# Altium schematic sheet logi-edu.SchDoc: Mark1 EDU Expansion
size B; Engineer: M. Jones; Organization: Michael Jones; Revision: RA.1; SheetNumber: 1; SheetTotal: 1; PageSetup: Record=PageOptions|CenterHorizontal=True|CenterVertical=True|PrintScale=0.70|XCorrection=1.00|YCorrection=1.00|PrintKind=0|BorderSize=5000000|LeftOffset=0|BottomOffset=0|Orientation=2|PaperLength=1000|PaperWidth=1000|Scale=100|PaperSource=7|PrintQuality=-4|MediaType=1|DitherType=10|PaperKind=Letter|PrintScaleMode=1
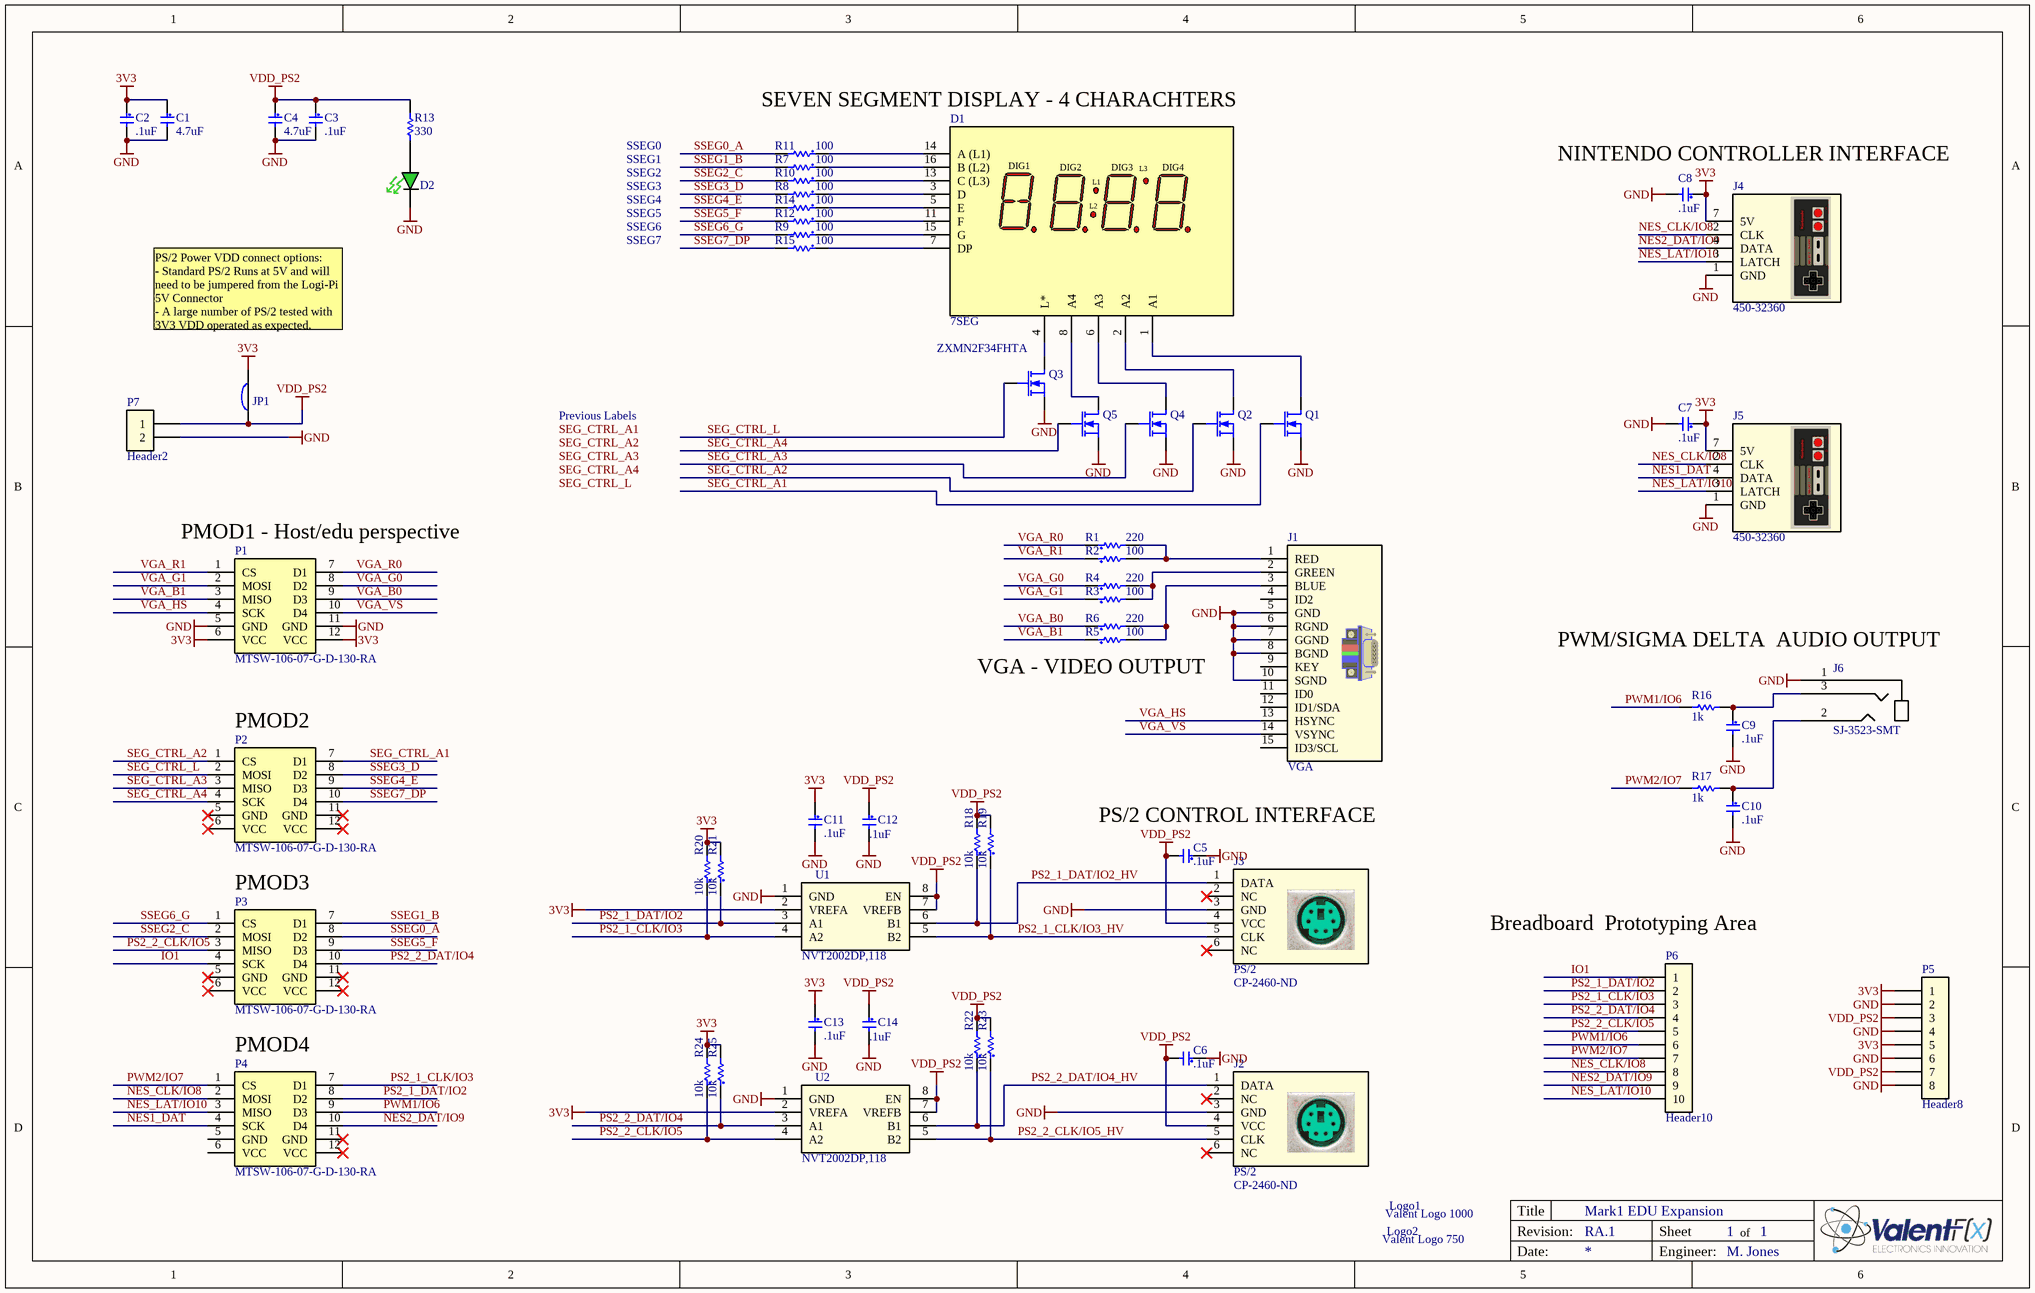
[diagram p0: logi-edu.SchDoc]

## Parts
C1  4.7uF  [C0603]
C2  .1uF  [C0603]
C3  .1uF  [C0603]
C4  4.7uF  [C0603]
C5  .1uF  [C0603]
C6  .1uF  [C0603]
C7  .1uF  [C0603]
C8  .1uF  [C0603]
C9  .1uF  [C0603]
C10  .1uF  [C0603]
C11  .1uF  [C0603]
C12  .1uF  [C0603]
C13  .1uF  [C0603]
C14  .1uF  [C0603]
D1  7SEG  [LED - SSEG - LTC-4727JR]
D2  LED 1.6X0.8MM 570NM GRN CLR SMD  [LED_0603 - GREEN]  (value not drawn)
J1  VGA  [1-1734530-1]
J2  PS/2  Supplier Part Number 1: CP-2460-ND  [MD-60S - PS/2]
J3  PS/2  Supplier Part Number 1: CP-2460-ND  [MD-60S - PS/2]
J4  450-32360  [NES - 450-32360]
J5  450-32360  [NES - 450-32360]
J6  SJ-3523-SMT  [SJ-3523-SMT]
JP1  Solder Jumper-NC  [SOLDER_JUMPER-NC]  (value not drawn)  (net tie, no BOM)
Logo1  Valent Logo 1000  [ValentFX_1000]
Logo2  Valent Logo 750  [ValentFX_750]
P1  MTSW-106-07-G-D-130-RA  [PMOD HEADER - Male]
P2  MTSW-106-07-G-D-130-RA  [PMOD HEADER - Male]
P3  MTSW-106-07-G-D-130-RA  [PMOD HEADER - Male]
P4  MTSW-106-07-G-D-130-RA  [PMOD HEADER - Male]
P5  Header8  [HEADER_8_40_100THRU SIP]
P6  Header10  [HEADER_10_40_100THRU SIP]
P7  Header2  [HEADER_2_40_100 THRU SIP]
Q1  ZXMN2F34FHTA  [SOT-23]  (value not drawn)
Q2  ZXMN2F34FHTA  [SOT-23]  (value not drawn)
Q3  ZXMN2F34FHTA  [SOT-23]
Q4  ZXMN2F34FHTA  [SOT-23]  (value not drawn)
Q5  ZXMN2F34FHTA  [SOT-23]  (value not drawn)
R1  220  [R0603]
R2  100  [R0603]
R3  100  [R0603]
R4  220  [R0603]
R5  100  [R0603]
R6  220  [R0603]
R7  100  [R0603]
R8  100  [R0603]
R9  100  [R0603]
R10  100  [R0603]
R11  100  [R0603]
R12  100  [R0603]
R13  330  [R0603]
R14  100  [R0603]
R15  100  [R0603]
R16  1k  [R0603]
R17  1k  [R0603]
R18  10k  [R0603]
R19  10k  [R0603]
R20  10k  [R0603]
R21  10k  [R0603]
R22  10k  [R0603]
R23  10k  [R0603]
R24  10k  [R0603]
R25  10k  [R0603]
U1  NVT2002DP,118  [NVT2002DP,118 - TSOP65P490X110-8L]
U2  NVT2002DP,118  [NVT2002DP,118 - TSOP65P490X110-8L]

## Nets
3V3: C1.1 C2.1 C7.1 C8.1 C11.1 C13.1 J4.7(5V) J5.7(5V) JP1.2 P1.6(VCC) P1.12(VCC) P5.1 P5.5 R20.2 R21.2 R24.2 R25.2 U1.2(VREFA) U2.2(VREFA)
GND: C1.2 C2.2 C3.2 C4.2 C5.1 C6.1 C7.2 C8.2 C9.2 C10.2 C11.2 C12.2 C13.2 C14.2 D2.C J1.5(GND) J1.6(RGND) J1.7(GGND) J1.8(BGND) J1.10(SGND) J2.3(GND) J3.3(GND) J4.1(GND) J5.1(GND) J6.1 P1.5(GND) P1.11(GND) P5.2 P5.4 P5.6 P5.8 P7.2 Q1.2 Q2.2 Q3.2 Q4.2 Q5.2 U1.1(GND) U2.1(GND)
VDD_PS2: C3.1 C4.1 C5.2 C6.2 C12.1 C14.1 J2.4(VCC) J3.4(VCC) JP1.1 P5.3 P5.7 P7.1 R13.1 R18.2 R19.2 R22.2 R23.2 U1.7(VREFB) U1.8(EN) U2.7(VREFB) U2.8(EN)
IO1: P3.4(SCK) P6.1
NES1_DAT: J5.4(DATA) P4.4(SCK)
NES2_DAT/IO9: J4.4(DATA) P4.10(D4) P6.9
NES_CLK/IO8: J4.2(CLK) J5.2(CLK) P4.2(MOSI) P6.8
NES_LAT/IO10: J4.3(LATCH) J5.3(LATCH) P4.3(MISO) P6.10
PS2_1_CLK/IO3: P4.7(D1) P6.3 R20.1 U1.4(A2)
PS2_1_CLK/IO3_HV: J3.5(CLK) R19.1 U1.5(B2)
PS2_1_DAT/IO2: P4.8(D2) P6.2 R21.1 U1.3(A1)
PS2_1_DAT/IO2_HV: J3.1(DATA) R18.1 U1.6(B1)
PS2_2_CLK/IO5: P3.3(MISO) P6.5 R24.1 U2.4(A2)
PS2_2_CLK/IO5_HV: J2.5(CLK) R23.1 U2.5(B2)
PS2_2_DAT/IO4: P3.10(D4) P6.4 R25.1 U2.3(A1)
PS2_2_DAT/IO4_HV: J2.1(DATA) R22.1 U2.6(B1)
PWM1/IO6: P4.9(D3) P6.6 R16.1
PWM2/IO7: P4.1(CS) P6.7 R17.1
SEG_CTRL_A1: P2.7(D1) Q1.1(G)
SEG_CTRL_A2: P2.1(CS) Q2.1(G)
SEG_CTRL_A3: P2.3(MISO) Q4.1(G)
SEG_CTRL_A4: P2.4(SCK) Q5.1(G)
SEG_CTRL_L: P2.2(MOSI) Q3.1(G)
SSEG0_A: P3.8(D2) R11.2
SSEG1_B: P3.7(D1) R7.2
SSEG2_C: P3.2(MOSI) R10.2
SSEG3_D: P2.8(D2) R8.2
SSEG4_E: P2.9(D3) R14.2
SSEG5_F: P3.9(D3) R12.2
SSEG6_G: P3.1(CS) R9.2
SSEG7_DP: P2.10(D4) R15.2
VGA_B0: P1.9(D3) R6.1
VGA_B1: P1.3(MISO) R5.1
VGA_G0: P1.8(D2) R4.1
VGA_G1: P1.2(MOSI) R3.1
VGA_HS: J1.13(HSYNC) P1.4(SCK)
VGA_R0: P1.7(D1) R1.1
VGA_R1: P1.1(CS) R2.1
VGA_VS: J1.14(VSYNC) P1.10(D4)
NetC9_1: C9.1 J6.3 R16.2
NetC10_1: C10.1 J6.2 R17.2
NetD1_1: D1.1(A1) Q1.3(D)
NetD1_2: D1.2(A2) Q2.3(D)
NetD1_3: D1.3(D) R8.1
NetD1_4: D1.4(L*) Q3.3(D)
NetD1_5: D1.5(E) R14.1
NetD1_6: D1.6(A3) Q4.3(D)
NetD1_7: D1.7(DP) R15.1
NetD1_8: D1.8(A4) Q5.3(D)
NetD1_11: D1.11(F) R12.1
NetD1_13: D1.13(C_(L3)) R10.1
NetD1_14: D1.14(A_(L1)) R11.1
NetD1_15: D1.15(G) R9.1
NetD1_16: D1.16(B_(L2)) R7.1
NetD2_A: D2.A R13.2
NetJ1_1: J1.1(RED) R1.2 R2.2
NetJ1_2: J1.2(GREEN) R3.2 R4.2
NetJ1_3: J1.3(BLUE) R5.2 R6.2

Not connected (* = marked no-connect by the designer): J1 4(ID2) 9(KEY) 11(ID0) 12(ID1/SDA) 15(ID3/SCL); J2 2(NC)* 6(NC)*; J3 2(NC)* 6(NC)*; P2 5(GND)* 6(VCC)* 11(GND)* 12(VCC)*; P3 5(GND)* 6(VCC)* 11(GND)* 12(VCC)*; P4 5(GND) 6(VCC) 11(GND)* 12(VCC)*

## Notes on the sheet
- SSEG0
- SSEG1
- SEVEN SEGMENT DISPLAY - 4 CHARACHTERS
- (near C8) NINTENDO CONTROLLER INTERFACE
- SSEG2
- SSEG3
- SSEG4
- SSEG5
- SSEG6
- SSEG7
- PS/2 Power VDD connect options:
  - Standard PS/2 Runs at 5V and will need to be jumpered from the Logi-Pi 5V Connector
  - A large number of PS/2 tested with 3V3 VDD operated as expected.
- Previous Labels
- (near P1) PMOD1 - Host/edu perspective
- (near R5) VGA - VIDEO OUTPUT
- (near J6) PWM/SIGMA DELTA  AUDIO OUTPUT
- (near P2) PMOD2
- (near C5) PS/2 CONTROL INTERFACE
- PMOD3
- (near P6) Breadboard  Prototyping Area
- PMOD4
- Labels drawn without touching a wire or pin: SEG_CTRL_A1, SEG_CTRL_A2, SEG_CTRL_A3, SEG_CTRL_A4, SEG_CTRL_L
- Title
- Revision:
- Sheet
- of
- Date:
- Engineer:
- (in symbol LED - SSEG - LTC-4727JR) DIG1; DIG2; DIG3; L3; DIG4; L1; L2

## Library data of the parts
C1 C4 = C0603 - GRM188F51A475ZE20D: 4.7uF 10volts Y5V +80-20% (MLCC) - SMD/SMT 0603; Manufacturer: Murata; Tolerance: - 20 %, + 80 %; Supplier 1: Mouser; Manufacturer Part Number: GRM188F51A475ZE20D; RoHS: RoHS Compliant By Exemption; Category: Multilayer Ceramic Capacitors (MLCC) - SMD/SMT; Stock 1: 32662; Pricing 1: 1=0.257, 50=0.159, 100=0.123, 500=0.065, 1000=0.046, 4000=0.032, 8000=0.028, 12000=0.024 (AUD); Capacitance: 4.7 uF; Dimensions: 0.8 mm W x 1.6 mm L x 0.8 mm H; Operating Temperature Range: - 30 C to + 85 C; Package / Case: 0603 (1608 metric); Packaging: Reel; Product: General Type MLCCs; Series: GRM; Termination Style: SMD/SMT; Voltage Rating: 10 Volts; Product Category: High Capacitance SMD Ceramic Chip Capacitors; Standard Pack Qty: 4000; Temperature Coefficient / Code: Y5V; RoHS - Mouser: E; Minimum Order Quantity: 1; Reeling: True; ComponentLink1URL: http://www.murata.com/products/catalog/pdf/c02e.pdf; ComponentLink1Description: http://www.murata.com/products/catalog/pdf/c02e.pdf; Supplier Part Number 1: 81-GRM188F51A475ZE20; Value: 4.7uF
C2 C3 C5-C14 = C0603 - GRM188R71H104KA93D: 0.1uF 50volts X7R 10% MLCC SMD/SMT 0603; Manufacturer: Murata; Supplier 1: Mouser; Manufacturer Part Number: GRM188R71H104KA93D; RoHS: RoHS Compliant By Exemption; Category: Multilayer Ceramic Capacitors (MLCC) - SMD/SMT; Stock 1: 327594; Pricing 1: 1=0.081, 50=0.054, 100=0.041, 500=0.018, 1000=0.015, 4000=0.012 (AUD); Capacitance: 0.1 uF; Dimensions: 0.8 mm W x 1.6 mm L x 0.8 mm H; Operating Temperature Range: - 55 C to + 125 C; Package / Case: 0603 (1608 metric); Packaging: Reel; Product: General Type MLCCs; Series: GRM; Termination Style: SMD/SMT; Tolerance: 10 %; Voltage Rating: 50 Volts; Product Category: Low & Medium Capacitance SMD Ceramic Chip Capacitors; Standard Pack Qty: 4000; Temperature Coefficient / Code: X7R; RoHS - Mouser: E; Minimum Order Quantity: 1; Reeling: True; ComponentLink1URL: http://www.murata.com/products/catalog/pdf/c02e.pdf; ComponentLink1Description: http://www.murata.com/products/catalog/pdf/c02e.pdf; Supplier Part Number 1: 81-GRM39X104K50D; Value: .1uF
D1 = LED - SSEG - LTC-4727JR: LED Displays & Accessories 4 Digit, Red Low Current; Manufacturer: Lite-On; Character Size: 10 mm; Display Type: 7 Segment; Operating Voltage: 2 V; Power Consumption: 70 mW; Wavelength: 631 nm; Common Pin: Common Cathode; Luminous Intensity: 975 ucd; Operating Current: 25 mA; Number of Digits: 4; Supplier 1: Mouser; Manufacturer Part Number: LTC-4727JR; RoHS: RoHS Compliant; Category: LED Displays & Accessories; Stock 1: 1398; Pricing 1: 1=2.88, 10=2.74, 50=2.67, 100=2.61, 500=2.31 (AUD); Illumination Color: Red; Packaging: Tube; Maximum Operating Temperature: + 85 C; Minimum Operating Temperature: - 35 C; Product Category: Numeric Display; Standard Pack Qty: 12; RoHS - Mouser: Y; Minimum Order Quantity: 1; Reeling: False; ComponentLink1URL: http://optoelectronics.liteon.com/en-us/product/detail.aspx?txtSpecNo=DS30-2000-193&txtPartNo=LTC-4727JR; ComponentLink1Description: http://optoelectronics.liteon.com/en-us/product/detail.aspx?txtSpecNo=DS30-2000-193&txtPartNo=LTC-4727JR
D2 = APT1608CGCK: Manufacturer: Kingbright Corp; Color: Green; Current - Test: 20mA; Wavelength - Peak: 574nm; Millicandela Rating: 50mcd; Voltage - Forward (Vf) Typ: 2.1V; Lens Type: Clear; Lens Style/Size: Rectangle, 1.2mm x 0.8mm; Viewing Angle: 120°; Value: LED 1.6X0.8MM 570NM GRN CLR SMD; Supplier 1: Digi-Key; Supplier Part Number 1: 754-1116-2-ND; Manufacturer Part Number: APT1608CGCK; RoHS: RoHS Compliant; Category: Optoelectronics; Stock 1: 94000; Pricing 1: 2000=0.051, 6000=0.045, 10000=0.043 (USD); Luminous Flux @ Current - Test: -; Wavelength - Dominant: 570nm; Size / Dimension: 1.60mm L x 0.80mm W; Height: 0.75mm; Package / Case: 0603 (1608 Metric); Mounting Type: Surface Mount; Packaging: Tape & Reel (TR); ComponentLink1URL: http://www.us.kingbright.com/images/catalog/SPEC/APT1608CGCK.pdf; ComponentLink1Description: http://www.us.kingbright.com/images/catalog/SPEC/APT1608CGCK.pdf
J1 = VGA - 1-1734530-1: CONN HD D-SUB RCPT R/A 15POS; Manufacturer: TE Connectivity; Connector Style: D-Sub, High Density; Number of Positions: 15; Connector Type: Receptacle, Female Sockets; Flange Feature: Housing/Shell (4-40); Voltage Rating: 125V; Current Rating: 2A; Supplier 1: Digi-Key; Manufacturer Part Number: 1-1734530-1; RoHS: RoHS Compliant; Category: Connectors, Interconnects; Stock 1: 6957; Pricing 1: 1=1.96, 10=1.779, 25=1.67, 50=1.5976, 100=1.525, 250=1.37972, 500=1.2708, 1000=1.08926, 2500=1.01664 (USD); Number of Rows: 3; Shell Size, Connector Layout: 1 (DE, E) High Density; Contact Type: Signal; Mounting Type: Through Hole, Right Angle; Termination: Solder; Features: Board Lock; Shell Material, Finish: Steel, Nickel Plated; Contact Finish: Gold; Contact Finish Thickness: Flash; Ingress Protection: -; Operating Temperature: -55°C ~ 105°C; Housing Material: Thermoplastic; Color: Black; ComponentLink1URL: http://documents.tycoelectronics.com/commerce/DocumentDelivery/DDEController?Action=srchrtrv&DocNm=1734530&DocType=CD&DocLang=EN; ComponentLink1Description: http://documents.tycoelectronics.com/commerce/DocumentDelivery/DDEController?Action=srchrtrv&DocNm=1734530&DocType=CD&DocLang=EN
J2 J3 = Con - D-60S: CONN MINIDIN RECPT UNSHIELD 6POS - PS/2 mouse - keybaord; Manufacturer: CUI Inc; Manufacturer Part Number: MD-60S; Connector Type: Receptacle, Female Sockets; Number of Positions: 6; Current Rating: 2A; Voltage - Rated: 12VDC; Supplier 1: Digi-Key; RoHS: RoHS Compliant; Category: Connectors, Interconnects; Stock 1: 13581; Pricing 1: 1=1.31, 10=1.018, 100=0.7763, 500=0.621, 1000=0.552, 2500=0.45885 (USD); Shell Size - Insert: Mini DIN; Shell Size, MIL: -; Mounting Type: Through Hole, Right Angle; Termination: Solder; Fastening Type: Push-Pull; Orientation: Keyed; Ingress Protection: -; Shell Material, Finish: Polybutylene Terephthalate (PBT); Contact Finish: Silver; Features: -; Packaging: Bulk; Contact Finish Thickness: -; Operating Temperature: -; ComponentLink1URL: http://products.cui.com/GetSpecForDigiKey.aspx?MFGNum=MD-60S; ComponentLink1Description: http://products.cui.com/GetSpecForDigiKey.aspx?MFGNum=MD-60S; Value: PS/2
J4 J5 = 450-32360: NES CONTROLLER SOCKET; Manufacturer: Parallax Inc; Accessory Type: Adapter NES Controller Socket; For Use With/Related Products: Game Systems, Development, Hobby and Education Projects; Supplier 1: Digi-Key; Manufacturer Part Number: 450-32360; RoHS: RoHS Compliant; Category: Programmers, Development Systems; Stock 1: 7; Pricing 1: 1=1.99 (USD); Supplier 2: Mouser; Stock 2: 0; Pricing 2: 1=1.85 (USD); Product Category: Basic Stamp Accessories; RoHS - Mouser: Y; Minimum Order Quantity: 1; Reeling: False; Supplier Part Number 1: 450-32360-ND; Supplier Part Number 2: 619-450-32360; Value: 450-32360
J6 = SJ-3523-SMT: CONN AUDIO JACK 3.5MM STEREO SMD; Manufacturer: CUI Inc; Source Part Number: CP-3523SJCT-ND; Connector Type: Phone Jack; Gender: Female; Plug/Mating Plug Diameter: 3.50mm (0.141", 1/8", Mini Plug) - Headphone; Number of Positions/Contacts: 3 Conductors, 3 Contacts; Internal Switch(s): Does Not Contain Switch; Shielding: Unshielded; Color - Contact: Black; Voltage - Rated: 12VDC; Current Rating: 1A; Manufacturer Part Number: SJ-3523-SMT; Source: Digikey; ROHS Certificate: ROHS-CUI.pdf; Supplier 1: Digi-Key; Supplier Part Number 1: CP-3523SJCT-ND; RoHS: RoHS Compliant; Category: Connectors, Interconnects; Stock 1: 68095; Pricing 1: 1=1.34, 10=1.043, 100=0.7961, 500=0.63558 (USD); Signal Lines: Stereo; Mounting Type: Surface Mount, Right Angle; Termination: Solder; Features: -; Contact Material: Copper Alloy; Contact Material - Plating: Silver; Housing Material: Plastic; Housing Color: Black; Operating Temperature: -25°C ~ 85°C; Packaging: Cut Tape (CT); ComponentLink1URL: http://products.cui.com/GetSpecForDigiKey.aspx?MFGNum=SJ-3523-SMT; ComponentLink1Description: http://products.cui.com/GetSpecForDigiKey.aspx?MFGNum=SJ-3523-SMT; Value: SJ-3523-SMT
JP1 = Solder Jumper-NC: Solder/Configuration Jumper; Manufacturer: n/a; Manufacturer Part Number: n/a; Source: n/a; Source Part Number: n/a; ROHS Certificate: n/a
P1-P4 = P-MOD - MTSW-106-07-G-D-130-RA: Samtec Male Conn Unshrouded Header HDR 12 POS 2.54mm Solder RA Thru-Hole; Lead Time: 0 weeks; Peak Solder Temperature: 260 deg C; MSL (Moisture Sensitivity Level): N/R; Supplier 1: Arrow; Manufacturer: Samtec; Manufacturer Part Number: MTSW-106-07-G-D-130-RA; RoHS: CHINA ROHS: Compliant / EU ROHS: Compliant; Stock 1: 0; Termination Finish: Au/Ni; China ROHS Lead (X -> above / O -> below threshold): O; China ROHS Mercury (X -> above / O -> below threshold): O; China ROHS Cadmium (X -> above / O -> below threshold): O; China ROHS Hex Chromium (X -> above / O -> below threshold): O; China ROHS PBB (X -> above / O -> below threshold): O; China ROHS PBDE (X -> above / O -> below threshold): O; EU_ROHS_PROD_EXEMPTION_BY_SUPP: N/R; ComponentLink1URL: http://components.arrow.com/partservice/dataview/altium/2717179?apiKey=aa438727d59eed98c4bed826d8d949c84cb5e685b92bf87346a0226bd2658797; ComponentLink1Description: http://components.arrow.com/partservice/dataview/altium/2717179?apiKey=aa438727d59eed98c4bed826d8d949c84cb5e685b92bf87346a0226bd2658797; Supplier Part Number 1: 2717179; =Value: MTSW-106-07-G-D-130-RA; Value: MTSW-106-07-G-D-130-RA
P5 = Header8: Header 8 pin
P6 = Header10: Header 10 pin
P7 = Header2: Header 2 pin
Q1-Q5 = ZXMN2F34FHTA: MOSFET N-CHAN 20V SOT23-3; Manufacturer: Diodes/Zetex; FET Type: MOSFET N-Channel, Metal Oxide; FET Feature: Logic Level Gate; Rds On (Max) @ Id, Vgs: 60 mOhm @ 2.5A, 4.5V; Current - Continuous Drain (Id) @ 25° C: 3.4A; Vgs(th) (Max) @ Id: 1.5V @ 250µA; Gate Charge (Qg) @ Vgs: 2.8nC @ 4.5V; Input Capacitance (Ciss) @ Vds: 277pF @ 10V; Power - Max: 950mW; Supplier 1: Digi-Key; Manufacturer Part Number: ZXMN2F34FHTA; RoHS: RoHS Compliant; Category: Discrete Semiconductor Products; Stock 1: 24122; Pricing 1: 1=0.55, 10=0.433, 100=0.2964, 250=0.247, 500=0.2052, 1000=0.152 (USD); Drain to Source Voltage (Vdss): 20V; Mounting Type: Surface Mount; Package / Case: SOT-23-3, TO-236-3, Micro3™, SSD3, SST3; Packaging: Cut Tape (CT); Supplier Device Package: *; ComponentLink1URL: http://www.diodes.com/datasheets/ZXMN2F34FH.pdf; ComponentLink1Description: http://www.diodes.com/datasheets/ZXMN2F34FH.pdf; Supplier Part Number 1: ZXMN2F34FHCT-ND; Value: ZXMN2F34FHTA
R1 R4 R6 = R0603 - ERJ-3EKF2200V: 220 - thick Film Resistors - SMD 0603 220ohms 1% Tol; Manufacturer: Panasonic - ECG; Power (Watts): 0.1W, 1/10W; Temperature Coefficient: ±100ppm/°C; Supplier 1: Digi-Key; Manufacturer Part Number: ERJ-3EKF2200V; RoHS: RoHS Compliant; Category: Resistors; Stock 1: 517798; Pricing 1: 1=0.1, 50=0.0138, 100=0.0105, 250=0.0078, 500=0.00576, 1000=0.00384 (USD); Resistance (Ohms): 220; Composition: Thick Film; Features: -; Tolerance: ±1%; Package / Case: 0603 (1608 Metric); Size / Dimension: 0.063" L x 0.031" W (1.60mm x 0.80mm); Height: 0.022" (0.55mm); Number of Terminations: 2; Packaging: Cut Tape (CT); ComponentLink1URL: http://industrial.panasonic.com/www-cgi/jvcr13pz.cgi?E+PZ+3+AOA0002+ERJ3EKF2200V+7+WW; ComponentLink1Description: http://industrial.panasonic.com/www-cgi/jvcr13pz.cgi?E+PZ+3+AOA0002+ERJ3EKF2200V+7+WW; Supplier Part Number 1: P220HCT-ND; Value: 220
R2 R3 R5 = R0603 - CRCW0603100RFKEA: 100 ohms 1% Thick Film Resistors - SMD 1/10watt; Manufacturer: Vishay/Dale; Power Rating: 0.1 Watt (1/10 Watt); Temperature Coefficient: 100 PPM / K; Voltage Rating: 75 Volts; Supplier 1: Mouser; Manufacturer Part Number: CRCW0603100RFKEA; RoHS: RoHS Compliant By Exemption; Category: Thick Film Resistors - SMD; Stock 1: 243353; Pricing 1: 1=0.108, 25=0.054, 100=0.034, 1000=0.020, 2000=0.018, 5000=0.008, 10000=0.007, 50000=0.005 (AUD); Dimensions: 0.85 mm W x 1.55 mm L x 0.45 mm H; Operating Temperature Range: - 55 C to + 155 C; Package / Case: 0603 (1608 metric); Packaging: Reel; Product: Thick Film Resistors SMD; Resistance: 100 Ohms; Series: CRCW; Termination Style: SMD/SMT; Tolerance: 1 %; Product Category: 0603 Thick Film Chip Resistors; Standard Pack Qty: 5000; RoHS - Mouser: E; Minimum Order Quantity: 1; Reeling: True; ComponentLink1URL: http://www.vishay.com/doc?20035; ComponentLink1Description: http://www.vishay.com/doc?20035; Supplier Part Number 1: 71-CRCW0603-100-E3; Value: 100
R7-R12 R14 R15 = Res-Eli: RES 10.0K OHM 1/10W 1% 0603 SMD; Manufacturer: Panasonic - ECG; Manufacturer Part Number: ERJ-3EKF1002V; Power (Watts): 0.1W, 1/10W; Temperature Coefficient: ±100ppm/°C; Value: 100; Supplier 1: Digi-Key; RoHS: RoHS Compliant; Category: Resistors; Stock 1: 11168880; Pricing 1: 1=0.04, 50=0.015, 100=0.0114, 250=0.00844, 500=0.00624, 1000=0.00416 (USD); Resistance (Ohms): 10.0K; Composition: Thick Film; Features: -; Tolerance: ±1%; Size / Dimension: 0.063" L x 0.031" W (1.60mm x 0.80mm); Height: 0.018" (0.45mm); Lead Style: Surface Mount (SMD - SMT); Packaging: Cut Tape (CT); Package / Case: 0603 (1608 Metric); ComponentLink1URL: http://industrial.panasonic.com/www-cgi/jvcr13pz.cgi?E+PZ+3+AOA0002+ERJ3EKF1002V+7+WW; ComponentLink1Description: http://industrial.panasonic.com/www-cgi/jvcr13pz.cgi?E+PZ+3+AOA0002+ERJ3EKF1002V+7+WW; Supplier Part Number 1: P10.0KHCT-ND
R13 = ERJ-3EKF3300V: RES 330 OHM 1/10W 1% 0603 SMD; Manufacturer: Panasonic - ECG; Power (Watts): 0.1W, 1/10W; Temperature Coefficient: ±100ppm/°C; Manufacturer Part Number: ERJ-3EKF3300V; Value: RES 330 OHM 1/10W 1% 0603 SMD; Supplier 1: Digi-Key; Supplier Part Number 1: P330HCT-ND; RoHS: RoHS Compliant; Category: Resistors; Stock 1: 592917; Pricing 1: 1=0.04, 50=0.015, 100=0.0114, 250=0.00844, 500=0.00624, 1000=0.00416 (USD); Resistance (Ohms): 330; Composition: Thick Film; Features: -; Tolerance: ±1%; Size / Dimension: 0.063" L x 0.031" W (1.60mm x 0.80mm); Height: 0.018" (0.45mm); Lead Style: Surface Mount (SMD - SMT); Packaging: Cut Tape (CT); Package / Case: 0603 (1608 Metric); ComponentLink1URL: http://industrial.panasonic.com/www-cgi/jvcr13pz.cgi?E+PZ+3+AOA0002+ERJ3EKF3300V+7+WW; ComponentLink1Description: http://industrial.panasonic.com/www-cgi/jvcr13pz.cgi?E+PZ+3+AOA0002+ERJ3EKF3300V+7+WW
R16 R17 = ERJ-3EKF1001V: RES 1.00K OHM 1/10W 1% 0603 SMD; Manufacturer: Panasonic - ECG; Power (Watts): 0.1W, 1/10W; Temperature Coefficient: ±100ppm/°C; Supplier 1: Digi-Key; Manufacturer Part Number: ERJ-3EKF1001V; RoHS: RoHS Compliant; Category: Resistors; Stock 1: 7422563; Pricing 1: 1=0.04, 50=0.015, 100=0.0114, 250=0.00844, 500=0.00624, 1000=0.00416 (USD); Resistance (Ohms): 1.00K; Composition: Thick Film; Features: -; Tolerance: ±1%; Size / Dimension: 0.063" L x 0.031" W (1.60mm x 0.80mm); Height: 0.018" (0.45mm); Lead Style: Surface Mount (SMD - SMT); Packaging: Cut Tape (CT); Package / Case: 0603 (1608 Metric); ComponentLink1URL: http://industrial.panasonic.com/www-cgi/jvcr13pz.cgi?E+PZ+3+AOA0002+ERJ3EKF1001V+7+WW; ComponentLink1Description: http://industrial.panasonic.com/www-cgi/jvcr13pz.cgi?E+PZ+3+AOA0002+ERJ3EKF1001V+7+WW; Value: 1k; Supplier Part Number 1: P1.00KHCT-ND
R18-R25 = R0603 - CRCW060310K0FKEA: 10k Thick Film Resistors - SMD 1/10watt 10Kohms 1%; Manufacturer: Vishay Dale; Power (Watts): 0.1W, 1/10W; Temperature Coefficient: ±100ppm/°C; Supplier 1: Digi-Key; Manufacturer Part Number: CRCW060310K0FKEA; RoHS: RoHS Compliant; Category: Resistors; Stock 1: 997856; Pricing 1: 10=0.081, 50=0.0436, 200=0.0251, 1000=0.01711 (USD); Resistance (Ohms): 10K; Composition: Thick Film; Features: -; Tolerance: ±1%; Package / Case: 0603 (1608 Metric); Size / Dimension: 0.061" L x 0.033" W (1.55mm x 0.85mm); Height: 0.020" (0.50mm); Number of Terminations: 2; Packaging: Cut Tape (CT); ComponentLink1URL: http://www.vishay.com/doc?20035; ComponentLink1Description: http://www.vishay.com/doc?20035; Supplier Part Number 1: 541-10.0KHCT-ND; Value: 10k
U1 U2 = NVT2002DP,118: Translation - Open Drain - 2 Lines - Voltage Levels Interface IC; Manufacturer: NXP Semiconductors; Supply Voltage - Max: 5 V; Supply Voltage - Min: 1 V; Notes: Logic Level translator - open drain; Supplier 1: Mouser; Manufacturer Part Number: NVT2002DP,118; RoHS: RoHS Compliant; Category: Translation - Voltage Levels; Stock 1: 1241; Pricing 1: 1=0.459, 25=0.424, 100=0.398, 250=0.379, 500=0.365, 1000=0.350, 2000=0.340, 2500=0.340, 4000=0.328, 10000=0.319 (AUD); Package / Case: TSSOP-8; Packaging: Reel; Mounting Style: SMD/SMT; Standard Pack Qty: 2500; RoHS - Mouser: Y; Minimum Order Quantity: 1; Reeling: True; ComponentLink1URL: http://www.mouser.com/ds/2/302/NVT2001_NVT2002-91266.pdf; ComponentLink1Description: http://www.mouser.com/ds/2/302/NVT2001_NVT2002-91266.pdf; Supplier Part Number 1: 771-NVT2002DP118; Value: NVT2002DP,118